# EAGLE schematic DTMF (EAGLE 6.1)
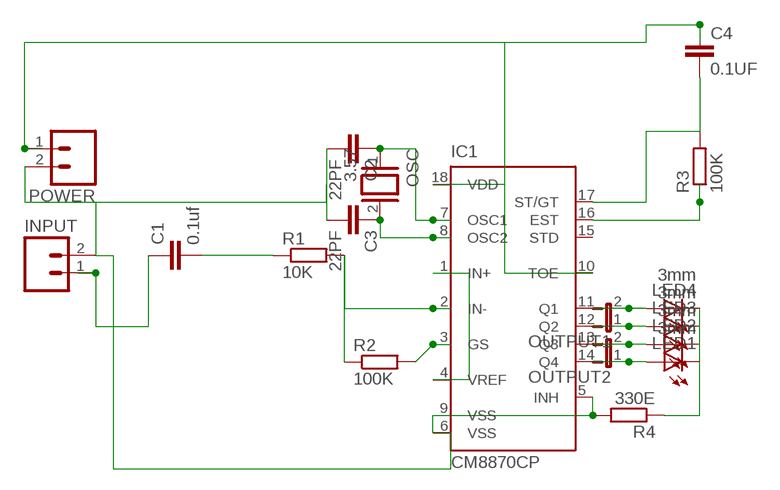
[diagram p0: schematic, sheet 1]

## Parts
C1  0.1uf  C2.5/2  [C2.5-2]
C2  22PF  C2.5/2  [C2.5-2]
C3  22PF  C2.5/2  [C2.5-2]
C4  0.1UF  C2.5/2  [C2.5-2]
IC1  CM8870CP  [DIL18]
INPUT  M02  [02P]
LED1  3mm  LED3MM  [LED3MM]
LED2  3mm  LED3MM  [LED3MM]
LED3  3mm  LED3MM  [LED3MM]
LED4  3mm  LED3MM  [LED3MM]
OSC  3.57  XTAL/S  [QS]
OUTPUT1  JP1E  [JP1]
OUTPUT2  JP1E  [JP1]
POWER  M02  [02P]
R1  10K  R-EU_0204/7  [0204/7]
R2  100K  R-EU_0204/7  [0204/7]
R3  100K  R-EU_0204/7  [0204/7]
R4  330E  R-EU_0204/7  [0204/7]

## Nets
N$1: C2.2 C3.2 IC1.5(INH) IC1.6(VSS) IC1.9(VSS) INPUT.2 POWER.2 R4.2
N$2: C1.2 R1.1
N$3: IC1.3(GS) R2.2
N$4: LED1.K(C) LED2.K(C) LED3.K(C) LED4.K(C) R4.1
N$5: IC1.11(Q1) LED4.A OUTPUT1.2
N$6: IC1.12(Q2) LED3.A OUTPUT1.1
N$7: IC1.13(Q3) LED2.A OUTPUT2.2
N$8: IC1.14(Q4) LED1.A OUTPUT2.1
N$10: C4.1 IC1.10(TOE) IC1.18(VDD) POWER.1
N$11: C1.1 INPUT.1
N$12: IC1.2(IN-) R1.2 R2.1
N$13: IC1.1(IN+) IC1.4(VREF)
N$14: C2.1 IC1.7(OSC1) OSC.1
N$15: C3.1 IC1.8(OSC2) OSC.2
N$17: IC1.16(EST) R3.1
N$24: C4.2 IC1.17(ST/GT) R3.2
Unconnected: IC1.15(STD)

## Library data of the parts
C1-C4 = capacitor-wima:C: CAPACITOR naming: grid - package width
IC1 = california-micro-devices:CM8870C: CMOS Integrated DTMF Receiver cm8870.pdf; OC_FARNELL: unknown; OC_NEWARK: unknown
INPUT POWER = con-amp-quick:M02: AMP QUICK CONNECTOR; OC_FARNELL: unknown; OC_NEWARK: unknown
LED1-LED4 = led:LED: LED OSRAM: - CHIPLED LG R971, LG N971, LY N971, LG Q971, LY Q971, LO R971, LY R971 LH N974, LH R974 LS Q976, LO Q976, LY Q976 LO Q996 - Hyper CHIPLED LW Q18S LB Q993, LB Q99A, LB R99A - SideLED LS A670, LO A670, LY A670, LG A670, LP A670 LB A673, LV A673, LT A673, LW A673 LH A674 LY A675 LS A676, LA A676, LO A676, LY A676, LW A676 LS A679, LY A679, LG A679 - Hyper Micro SIDELED® LS Y876, LA Y876, LO Y876, LY Y876 LT Y87S - SmartLED LW L88C, LW L88S LB L89C, LB L89S, LG L890 LS L89K, LO L89K, LY L89K LS L896, LA L896, LO L896, LY L896 - TOPLED LS T670, LO T670, LY T670, LG T670, LP T670 LSG T670, LSP T670, LSY T670, LOP T670, LYG T670 LG T671, LOG T671, LSG T671 LB T673, LV T673, LT T673, LW T673 LH T674 LS T676, LA T676, LO T676, LY T676, LB T676, LH T676, LSB T676, LW T676 LB T67C, LV T67C, LT T67C, LS T67K, LO T67K, LY T67K, LW E67C LS E67B, LA E67B, LO E67B, LY E67B, LB E67C, LV E67C, LT E67C LW T67C LS T679, LY T679, LG T679 LS T770, LO T770, LY T770, LG T770, LP T770 LB T773, LV T773, LT T773, LW T773 LH T774 LS E675, LA E675, LY E675, LS T675 LS T776, LA T776, LO T776, LY T776, LB T776 LHGB T686 LT T68C, LB T68C - Hyper Mini TOPLED® LB M676 - Mini TOPLED Santana® LG M470 LS M47K, LO M47K, LY M47K Source: http://www.osram.convergy.de LUXEON: - LUMILED® LXK2-PW12-R00, LXK2-PW12-S00, LXK2-PW14-U00, LXK2-PW14-V00 LXK2-PM12-R00, LXK2-PM12-S00, LXK2-PM14-U00 LXK2-PE12-Q00, LXK2-PE12-R00, LXK2-PE12-S00, LXK2-PE14-T00, LXK2-PE14-U00 LXK2-PB12-K00, LXK2-PB12-L00, LXK2-PB12-M00, LXK2-PB14-N00, LXK2-PB14-P00, LXK2-PB14-Q00 LXK2-PR12-L00, LXK2-PR12-M00, LXK2-PR14-Q00, LXK2-PR14-R00 LXK2-PD12-Q00, LXK2-PD12-R00, LXK2-PD12-S00 LXK2-PH12-R00, LXK2-PH12-S00 LXK2-PL12-P00, LXK2-PL12-Q00, LXK2-PL12-R00 Source: www.luxeon.com KINGBRIGHT: KA-3528ASYC Source: www.kingbright.com
OSC = special:XTAL/S: CRYSTAL
OUTPUT1 OUTPUT2 = jumper:JP1E: JUMPER
R1-R4 = rcl:R-EU_: RESISTOR, European symbol